# EAGLE design OneSLiPoCharger (EAGLE 7.7.0)
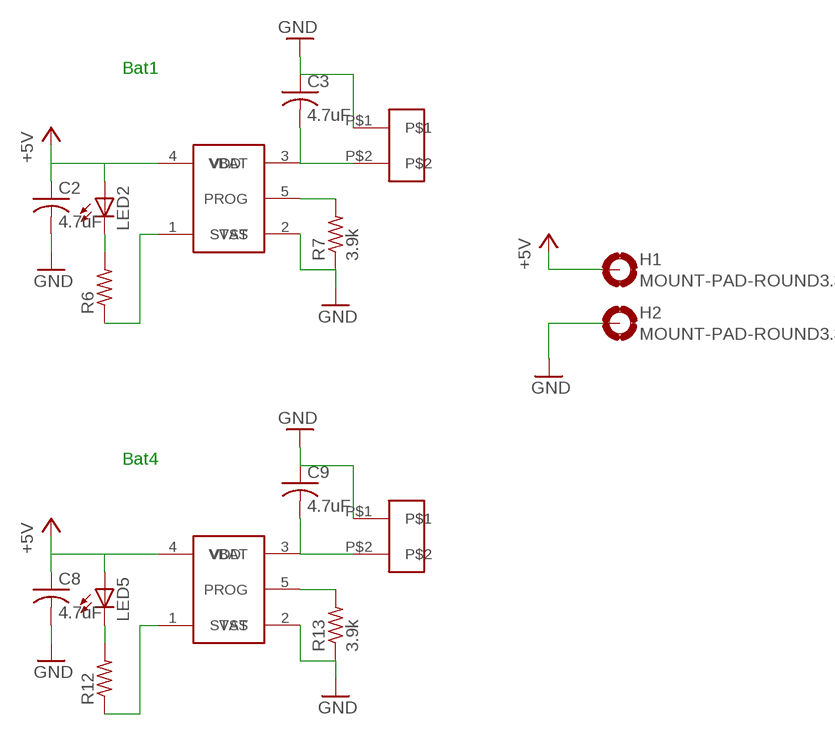
[diagram p0: schematic, sheet 1]

## Parts
C2  4.7uF  C-USC0805  [C0805]
C3  4.7uF  C-USC0805  [C0805]
C8  4.7uF  C-USC0805  [C0805]
C9  4.7uF  C-USC0805  [C0805]
H1  MOUNT-PAD-ROUND3.3  [3,3-PAD]
H2  MOUNT-PAD-ROUND3.3  [3,3-PAD]
LED2  LED3MM  [LED3MM]
LED5  LED3MM  [LED3MM]
R6  R-US_M0805  [M0805]
R7  3.9k  R-US_M0805  [M0805]
R12  R-US_M0805  [M0805]
R13  3.9k  R-US_M0805  [M0805]
U$1  MCP73831  [MCP73831-SOT23]
U$2  PICOBLADE-2PIN  [PICOBLADE-2PIN]
U$8  MCP73831  [MCP73831-SOT23]
U$9  PICOBLADE-2PIN  [PICOBLADE-2PIN]

## Nets
+5V: C2.1 C8.1 H1.B3,3(MOUNT) LED2.A LED5.A U$1.4(VDD) U$8.4(VDD)
GND: C2.2 C3.1 C8.2 C9.1 H2.B3,3(MOUNT) R7.1 R13.1 U$1.2(VSS) U$2.P$1 U$8.2(VSS) U$9.P$1
N$6: LED2.K(C) R6.2
N$7: R6.1 U$1.1(STAT)
N$8: R7.2 U$1.5(PROG)
N$9: C3.2 U$1.3(VBAT) U$2.P$2
N$19: LED5.K(C) R12.2
N$20: R12.1 U$8.1(STAT)
N$21: R13.2 U$8.5(PROG)
N$22: C9.2 U$8.3(VBAT) U$9.P$2

## Notes on the sheet
- Bat1
- Bat4

## Library data of the parts
C2 C3 C8 C9 = rcl:C-US: CAPACITOR, American symbol
H1 H2 = holes:MOUNT-PAD-ROUND: MOUNTING PAD, round
LED2 LED5 = led:LED: LED OSRAM: - CHIPLED LG R971, LG N971, LY N971, LG Q971, LY Q971, LO R971, LY R971 LH N974, LH R974 LS Q976, LO Q976, LY Q976 LO Q996 - Hyper CHIPLED LW Q18S LB Q993, LB Q99A, LB R99A - SideLED LS A670, LO A670, LY A670, LG A670, LP A670 LB A673, LV A673, LT A673, LW A673 LH A674 LY A675 LS A676, LA A676, LO A676, LY A676, LW A676 LS A679, LY A679, LG A679 - Hyper Micro SIDELED® LS Y876, LA Y876, LO Y876, LY Y876 LT Y87S - SmartLED LW L88C, LW L88S LB L89C, LB L89S, LG L890 LS L89K, LO L89K, LY L89K LS L896, LA L896, LO L896, LY L896 - TOPLED LS T670, LO T670, LY T670, LG T670, LP T670 LSG T670, LSP T670, LSY T670, LOP T670, LYG T670 LG T671, LOG T671, LSG T671 LB T673, LV T673, LT T673, LW T673 LH T674 LS T676, LA T676, LO T676, LY T676, LB T676, LH T676, LSB T676, LW T676 LB T67C, LV T67C, LT T67C, LS T67K, LO T67K, LY T67K, LW E67C LS E67B, LA E67B, LO E67B, LY E67B, LB E67C, LV E67C, LT E67C LW T67C LS T679, LY T679, LG T679 LS T770, LO T770, LY T770, LG T770, LP T770 LB T773, LV T773, LT T773, LW T773 LH T774 LS E675, LA E675, LY E675, LS T675 LS T776, LA T776, LO T776, LY T776, LB T776 LHGB T686 LT T68C, LB T68C - Hyper Mini TOPLED® LB M676 - Mini TOPLED Santana® LG M470 LS M47K, LO M47K, LY M47K Source: http://www.osram.convergy.de LUXEON: - LUMILED® LXK2-PW12-R00, LXK2-PW12-S00, LXK2-PW14-U00, LXK2-PW14-V00 LXK2-PM12-R00, LXK2-PM12-S00, LXK2-PM14-U00 LXK2-PE12-Q00, LXK2-PE12-R00, LXK2-PE12-S00, LXK2-PE14-T00, LXK2-PE14-U00 LXK2-PB12-K00, LXK2-PB12-L00, LXK2-PB12-M00, LXK2-PB14-N00, LXK2-PB14-P00, LXK2-PB14-Q00 LXK2-PR12-L00, LXK2-PR12-M00, LXK2-PR14-Q00, LXK2-PR14-R00 LXK2-PD12-Q00, LXK2-PD12-R00, LXK2-PD12-S00 LXK2-PH12-R00, LXK2-PH12-S00 LXK2-PL12-P00, LXK2-PL12-Q00, LXK2-PL12-R00 Source: www.luxeon.com KINGBRIGHT: KA-3528ASYC Source: www.kingbright.com
R6 R7 R12 R13 = rcl:R-US_: RESISTOR, American symbol
U$1 U$8 = MCP73831:MCP73831
U$2 U$9 = Picoblade:PICOBLADE-2PIN

## Board
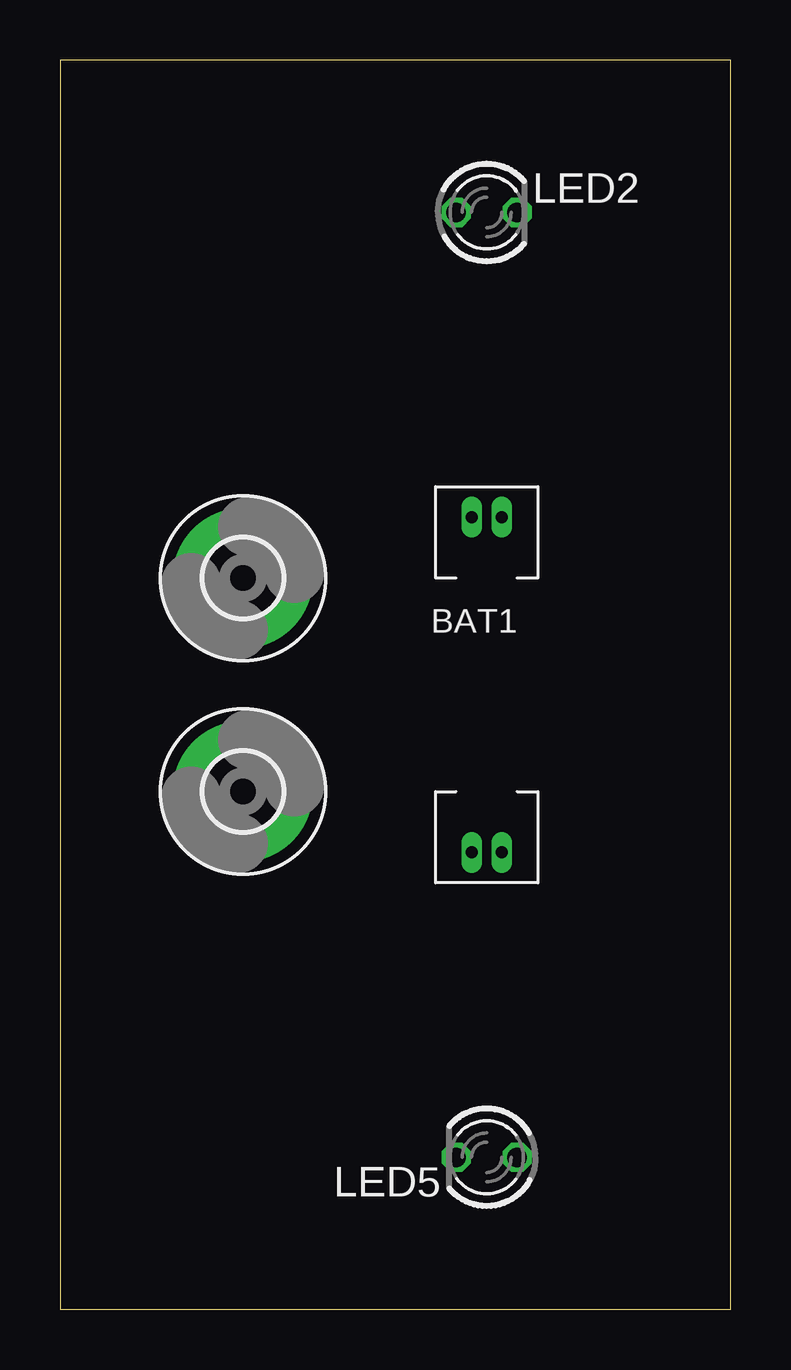
[diagram p1: board, top side]
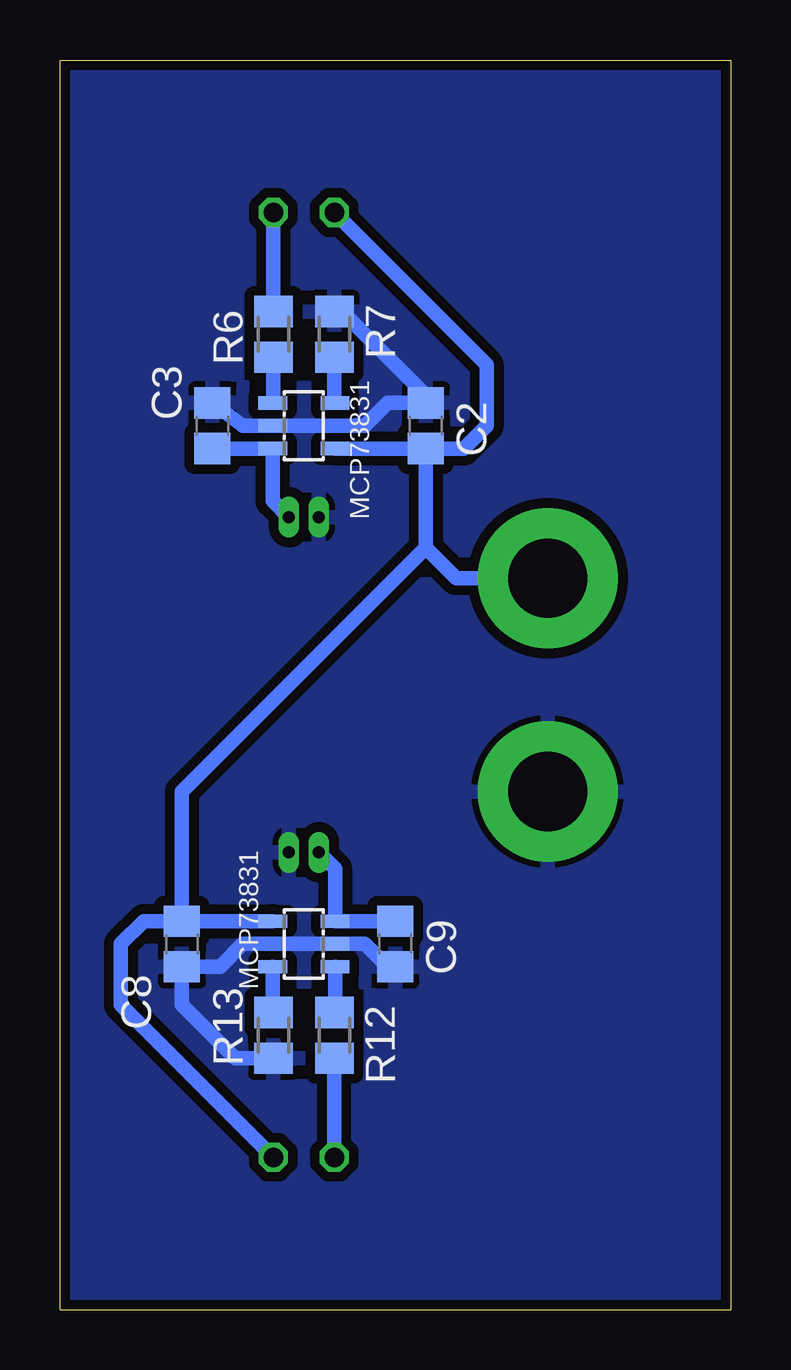
[diagram p2: board, bottom side, seen from below]

Size 27.94 x 52.07 mm. Coordinates in mm from the lower left corner, seen from the top.
Outline: 27.94,0 27.94,52.07 0,52.07 0,0 27.94,0
Copper layers (1*16): Top 0.0356mm / dielectric 1.5011mm / Bottom 0.0356mm
Design rules "LaenPCBOrder": minimum track width 6mil, minimum drill 13mil, track to track 6mil, track to pad 6mil, pad to pad 6mil, via to via 6mil, smd to smd 6mil, copper to edge 15mil, drill to drill 6mil, minimum pad ring 7mil, minimum via ring 7mil, stop-mask expansion 3mil, vias tented up to drill 0mil, thermal gap 10mil

### Footprints (pad centres in the part's own frame; a part is rotated, then mirrored left to right if it is on the bottom)
C0805 = smd 1.3 x 1.5: 1 -0.95,0; 2 0.95,0
3,3-PAD = drill 3.3 pad 5.842: B3,3 0,0
LED3MM = drill 0.813 octagon: A -1.27,0; K 1.27,0
M0805 = smd 1.3 x 1.6: 1 -0.95,0; 2 0.95,0
MCP73831-SOT23 = smd 0.55 x 1.2: 1 -0.95,-1.3; 2 0,-1.3; 3 0.95,-1.3; 4 0.95,1.3; 5 -0.95,1.3
PICOBLADE-2PIN = drill 0.5 pad 0.711 long: P$1 -0.625,0; P$2 0.625,0

### Placement (x,y rotation side)
C2  12.7,36.83 90 bottom
C3  21.59,36.83 270 bottom
C8  22.86,15.24 270 bottom
C9  13.97,15.24 90 bottom
DRILEGEND  [DRILEGEND]  -17.78,-9.8 0 top  (outside the outline)
H1  7.62,30.48 0 top
H2  7.62,21.59 0 top
LED2  17.78,45.72 0 top
LED5  17.78,6.35 180 top
R6  19.05,40.64 90 bottom
R7  16.51,40.64 270 bottom
R12  16.51,11.43 270 bottom
R13  19.05,11.43 90 bottom
U$1  17.78,36.83 270 bottom
U$2  17.78,33.02 0 top
U$8  17.78,15.24 90 bottom
U$9  17.78,19.05 180 top

### Tracks (layer width: path | path; a pad name or v marks a point on that pad's centre or on a via)
+5V
  Bottom 0.61: C2.1 U$1.4 | LED2.A 10.16,39.37 10.16,36.83 11.11,35.88 C2.1 | C8.1 U$8.4 | C8.1 24.45,16.19 25.4,15.24 25.4,12.7 LED5.A | C8.1 22.86,21.59 12.7,31.75 | C2.1 12.7,31.75 | H1.B3,3 11.43,30.48 12.7,31.75
GND
  Bottom 0.61: R7.1 16.19,41.59 12.7,38.1 C2.2 14.29,37.78 15.24,36.83 U$1.2 20.32,36.83 C3.1 | C9.1 14.29,14.29 15.24,15.24 U$8.2 20.32,15.24 21.27,14.29 C8.2 22.86,12.7 20.64,10.48 R13.1
  pour Bottom (isolate 0.406): 0,0 27.94,0 27.94,52.07 0,52.07
N$6
  Bottom 0.61: LED2.K R6.2
N$7
  Bottom 0.61: U$1.1 19.05,37.81 R6.1
N$8
  Bottom 0.61: U$1.5 16.51,37.81 R7.2
N$9
  Bottom 0.61: C3.2 U$1.3 19.08,33.7 U$2.P$2
N$19
  Bottom 0.61: LED5.K R12.2
N$20
  Bottom 0.61: R12.1 16.48,12.41 U$8.1
N$21
  Bottom 0.61: U$8.5 19.08,12.38 R13.2
N$22
  Bottom 0.61: U$9.P$2 16.48,18.38 U$8.3 C9.2

### Text on the board
tPlace: BAT1
tNames: BAT4